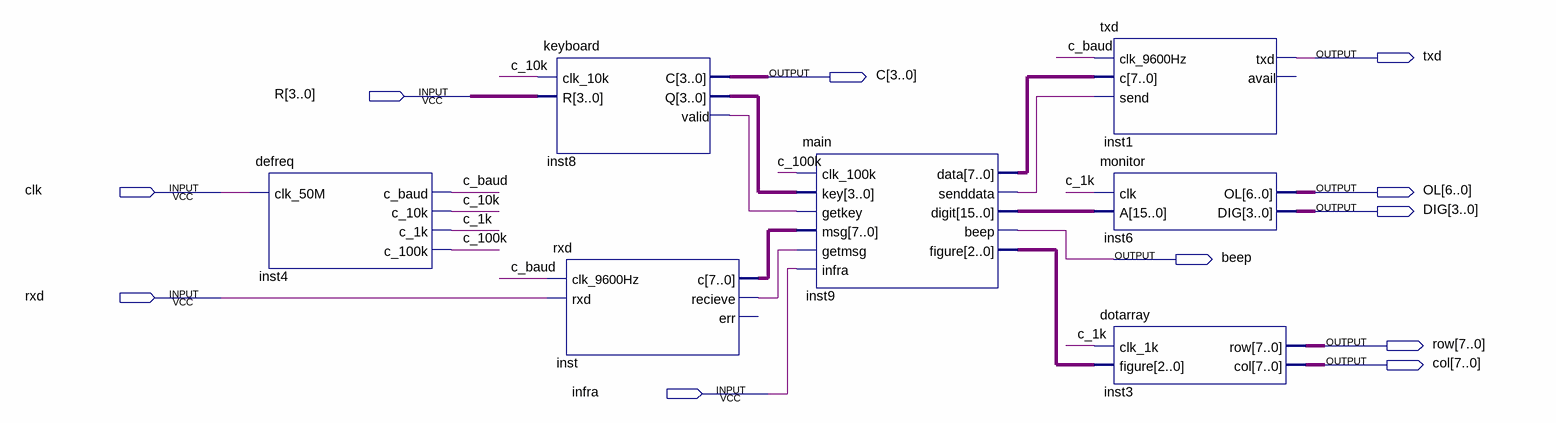
[diagram p0: schematic sheet]
// Quartus schematic receiver.bdf as structural Verilog: 7 symbols, 11 pins
module receiver (
  input  [3:0] R,
  input  clk,
  input  rxd,
  input  infra,
  output txd,
  output [3:0] C,
  output [6:0] OL,
  output [3:0] DIG,
  output beep,
  output [7:0] row,
  output [7:0] col
);

  wire c_1k, c_10k, c_100k, c_baud, inst8_valid, inst9_senddata, inst_recieve;
  wire [2:0] inst9_figure;
  wire [3:0] inst8_q;
  wire [7:0] inst9_data, inst_c;
  wire [15:0] inst9_digit;

  defreq inst4 (.clk_50M(clk), .c_baud(c_baud), .c_10k(c_10k), .c_1k(c_1k), .c_100k(c_100k));
  keyboard inst8 (.clk_10k(c_10k), .R(R), .C(C), .Q(inst8_q), .valid(inst8_valid));
  rxd inst (.clk_9600Hz(c_baud), .rxd(rxd), .c(inst_c), .recieve(inst_recieve));  // open: err
  main inst9 (
    .clk_100k(c_100k), .key(inst8_q), .getkey(inst8_valid), .msg(inst_c), .getmsg(inst_recieve),
    .infra(infra), .data(inst9_data), .senddata(inst9_senddata), .digit(inst9_digit), .beep(beep),
    .figure(inst9_figure));
  txd inst1 (.clk_9600Hz(c_baud), .c(inst9_data), .send(inst9_senddata), .txd(txd));  // open: avail
  monitor inst6 (.clk(c_1k), .A(inst9_digit), .OL(OL), .DIG(DIG));
  dotarray inst3 (.clk_1k(c_1k), .figure(inst9_figure), .row(row), .col(col));
endmodule
